# Altium project telecar.PrjPcb
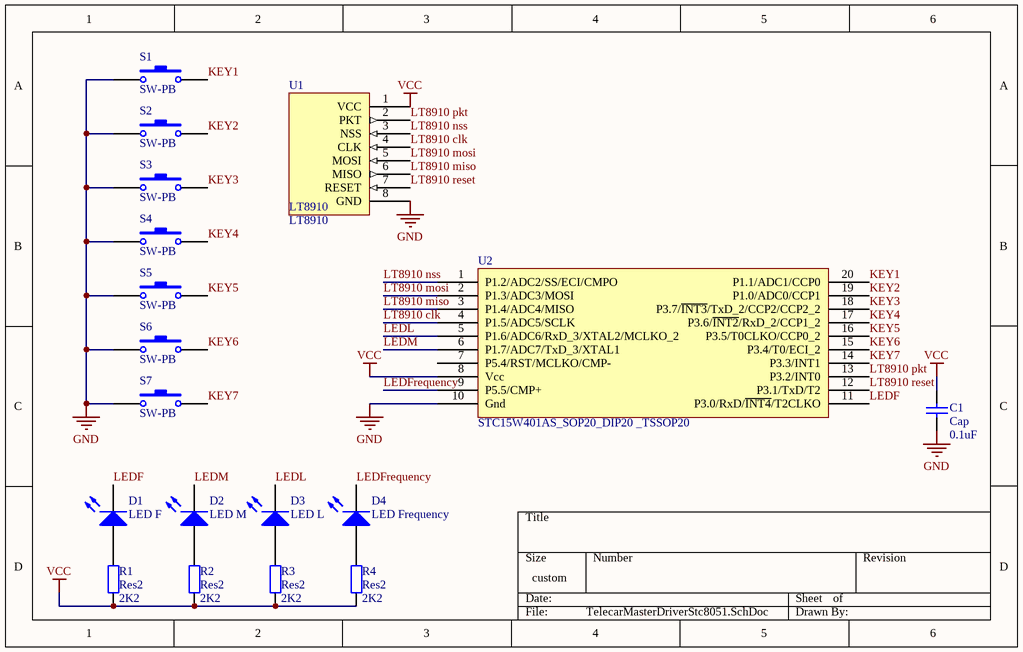
[diagram p0: TelecarMasterDriverStc8051.SchDoc]
2 sheets, 39 parts. Net scope: global (net labels, ports and power ports of the same name join across sheets).
Board files: TelecarMasterDriverStc8051.PcbDoc, TelecarRemoteControlStc8051.PcbDoc
Sheets:
  TelecarMasterDriverStc8051.SchDoc
  TelecarRemoteControlStc8051.SchDoc

## Sheet TelecarMasterDriverStc8051.SchDoc
size 190 x 120 mm; PageSetup: Record=PageOptions?CenterHorizontal=True?CenterVertical=True?PrintScale=0.67?XCorrection=1.00?YCorrection=1.00?PrintKind=1?BorderSize=5000000?LeftOffset=0?BottomOffset=0?Orientation=2?PaperLength=1000?PaperWidth=1000?Scale=100?PaperSource=7?PrintQuality=-4?MediaType=1?DitherType=10?PaperKind=A5?PrintScaleMode=1

### Parts
C1  Cap  value 0.1uF  [RAD-0.3]
D1  LED F  [LED-1]
D2  LED M  [LED-1]
D3  LED L  [LED-1]
D4  LED Frequency  [LED-1]
R1  Res2  value 2K2  [AXIAL-0.4]
R2  Res2  value 2K2  [AXIAL-0.4]
R3  Res2  value 2K2  [AXIAL-0.4]
R4  Res2  value 2K2  [AXIAL-0.4]
S1  SW-PB  [SPST-2]
S2  SW-PB  [SPST-2]
S3  SW-PB  [SPST-2]
S4  SW-PB  [SPST-2]
S5  SW-PB  [SPST-2]
S6  SW-PB  [SPST-2]
S7  SW-PB  [SPST-2]
U1  LT8910
U2  STC15W401AS_SOP20_DIP20 _TSSOP20  [TSSOP20]

### Nets
GND: C1.1 S1.1 S2.1 S3.1 S4.1 S5.1 S6.1 S7.1 U1.8(GND) U2.10(Gnd)
VCC: C1.2 R1.1 R2.1 R3.1 R4.1 U1.1(VCC) U2.8(Vcc)
KEY1: S1.2 U2.20(P1.1/ADC1/CCP0)
KEY2: S2.2 U2.19(P1.0/ADC0/CCP1)
KEY3: S3.2 U2.18(P3.7/~{INT3}/TxD_2/CCP2/CCP2_2)
KEY4: S4.2 U2.17(P3.6/~{INT2}/RxD_2/CCP1_2)
KEY5: S5.2 U2.16(P3.5/T0CLKO/CCP0_2)
KEY6: S6.2 U2.15(P3.4/T0/ECI_2)
KEY7: S7.2 U2.14(P3.3/INT1)
LEDF: D1.2(K) U2.11(P3.0/RxD/~{INT4}/T2CLKO)
LEDFrequency: D4.2(K) U2.9(P5.5/CMP+)
LEDL: D3.2(K) U2.5(P1.6/ADC6/RxD_3/XTAL2/MCLKO_2)
LEDM: D2.2(K) U2.6(P1.7/ADC7/TxD_3/XTAL1)
LT8910 clk: U1.4(CLK) U2.4(P1.5/ADC5/SCLK)
LT8910 miso: U1.6(MISO) U2.3(P1.4/ADC4/MISO)
LT8910 mosi: U1.5(MOSI) U2.2(P1.3/ADC3/MOSI)
LT8910 nss: U1.3(NSS) U2.1(P1.2/ADC2/SS/ECI/CMPO)
LT8910 pkt: U1.2(PKT) U2.13(P3.2/INT0)
LT8910 reset: U1.7(RESET) U2.12(P3.1/TxD/T2)
NetD1_1: D1.1(A) R1.2
NetD2_1: D2.1(A) R2.2
NetD3_1: D3.1(A) R3.2
NetD4_1: D4.1(A) R4.2

Not connected (* = marked no-connect by the designer): U2 7(P5.4/RST/MCLKO/CMP-)

### Library data of the parts
C1 = Cap: Capacitor; Published: 8-Jun-2000; LatestRevisionDate: 17-Jul-2002; LatestRevisionNote: Re-released for DXP Platform.; PackageReference: RAD-0.3; Publisher: Altium Limited
D1-D4 = LED1: Typical RED GaAs LED; Published: 8-Jun-2000; LatestRevisionDate: 08-Jul-2005; LatestRevisionNote: Mech Layer 1 removed.; PackageReference: LED-1; Publisher: Altium Limited
R1-R4 = Res2: Resistor; Published: 8-Jun-2000; LatestRevisionDate: 17-Jul-2002; LatestRevisionNote: Re-released for DXP Platform.; PackageReference: AXIAL-0.4; Publisher: Altium Limited
S1-S7 = SW-PB: Switch; Published: 24-Mar-1999; LatestRevisionDate: 17-Jul-2002; LatestRevisionNote: Re-released for DXP Platform.; PackageReference: SPST-2; Publisher: Altium Limited

## Sheet TelecarRemoteControlStc8051.SchDoc
size 190 x 120 mm
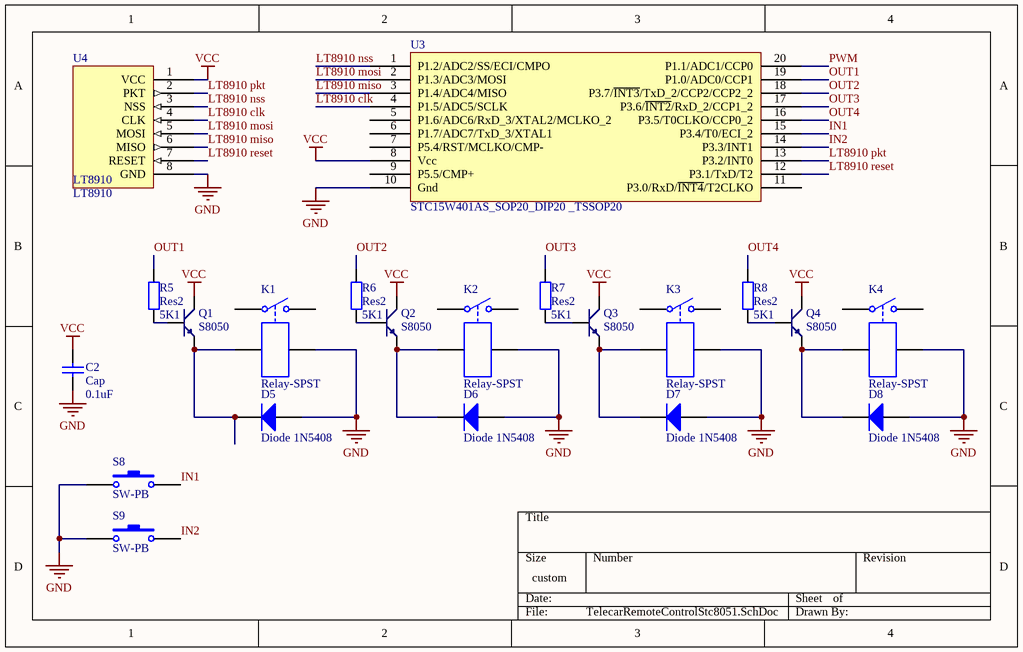
[diagram p1: TelecarRemoteControlStc8051.SchDoc]

### Parts
C2  Cap  value 0.1uF  [RAD-0.3]
D5  Diode 1N5408  [DIO18.84-9.6x5.6]
D6  Diode 1N5408  [DIO18.84-9.6x5.6]
D7  Diode 1N5408  [DIO18.84-9.6x5.6]
D8  Diode 1N5408  [DIO18.84-9.6x5.6]
K1  Relay-SPST  [DIP-P4]
K2  Relay-SPST  [DIP-P4]
K3  Relay-SPST  [DIP-P4]
K4  Relay-SPST  [DIP-P4]
Q1  S8050  [SOT-23R]
Q2  S8050  [SOT-23R]
Q3  S8050  [SOT-23R]
Q4  S8050  [SOT-23R]
R5  Res2  value 5K1  [AXIAL-0.4]
R6  Res2  value 5K1  [AXIAL-0.4]
R7  Res2  value 5K1  [AXIAL-0.4]
R8  Res2  value 5K1  [AXIAL-0.4]
S8  SW-PB  [SPST-2]
S9  SW-PB  [SPST-2]
U3  STC15W401AS_SOP20_DIP20 _TSSOP20  [TSSOP20]
U4  LT8910

### Nets
GND: C2.1 D5.1(A) D6.1(A) D7.1(A) D8.1(A) K1.4 K2.4 K3.4 K4.4 S8.1 S9.1 U3.10(Gnd) U4.8(GND)
VCC: C2.2 Q1.3(C) Q2.3(C) Q3.3(C) Q4.3(C) U3.8(Vcc) U4.1(VCC)
IN1: S8.2 U3.15(P3.4/T0/ECI_2)
IN2: S9.2 U3.14(P3.3/INT1)
LT8910 clk: U3.4(P1.5/ADC5/SCLK) U4.4(CLK)
LT8910 miso: U3.3(P1.4/ADC4/MISO) U4.6(MISO)
LT8910 mosi: U3.2(P1.3/ADC3/MOSI) U4.5(MOSI)
LT8910 nss: U3.1(P1.2/ADC2/SS/ECI/CMPO) U4.3(NSS)
LT8910 pkt: U3.13(P3.2/INT0) U4.2(PKT)
LT8910 reset: U3.12(P3.1/TxD/T2) U4.7(RESET)
OUT1: R5.2 U3.19(P1.0/ADC0/CCP1)
OUT2: R6.2 U3.18(P3.7/~{INT3}/TxD_2/CCP2/CCP2_2)
OUT3: R7.2 U3.17(P3.6/~{INT2}/RxD_2/CCP1_2)
OUT4: R8.2 U3.16(P3.5/T0CLKO/CCP0_2)
PWM: U3.20(P1.1/ADC1/CCP0)
NetD5_2: D5.2(K) K1.3 Q1.1(E)
NetD6_2: D6.2(K) K2.3 Q2.1(E)
NetD7_2: D7.2(K) K3.3 Q3.1(E)
NetD8_2: D8.2(K) K4.3 Q4.1(E)
NetQ1_2: Q1.2(B) R5.1
NetQ2_2: Q2.2(B) R6.1
NetQ3_2: Q3.2(B) R7.1
NetQ4_2: Q4.2(B) R8.1

Not connected (* = marked no-connect by the designer): K1 1 2; K2 1 2; K3 1 2; K4 1 2; U3 5(P1.6/ADC6/RxD_3/XTAL2/MCLKO_2) 6(P1.7/ADC7/TxD_3/XTAL1) 7(P5.4/RST/MCLKO/CMP-) 9(P5.5/CMP+) 11(P3.0/RxD/~{INT4}/T2CLKO)

### Library data of the parts
C2 = Cap: Capacitor; Published: 8-Jun-2000; LatestRevisionDate: 17-Jul-2002; LatestRevisionNote: Re-released for DXP Platform.; PackageReference: RAD-0.3; Publisher: Altium Limited
D5-D8 = Diode 1N5408: 3 Amp Medium Power Silicon Rectifier Diode; Published: 8-Jun-2000; LatestRevisionDate: 17-Jul-2002; LatestRevisionNote: Re-released for DXP Platform.; DatasheetVersion: Aug-1984; PackageReference: DO-201AD; Publisher: Altium Limited; ComponentLink1Description: Manufacturer Link; ComponentLink1URL: http://www.irf.com/
K1-K4 = Relay-SPST: Single-Pole Single-Throw Relay; Published: 24-Mar-1999; LatestRevisionDate: 17-Jul-2002; LatestRevisionNote: Re-released for DXP Platform.; PackageReference: MODULE4; Publisher: Altium Limited
Q1-Q4 = NPN: 8050/BCW846/BCW847
R5-R8 = Res2: Resistor; Published: 8-Jun-2000; LatestRevisionDate: 17-Jul-2002; LatestRevisionNote: Re-released for DXP Platform.; PackageReference: AXIAL-0.4; Publisher: Altium Limited
S8 S9 = SW-PB: Switch; Published: 24-Mar-1999; LatestRevisionDate: 17-Jul-2002; LatestRevisionNote: Re-released for DXP Platform.; PackageReference: SPST-2; Publisher: Altium Limited

## Nets that join several sheets
GND: TelecarMasterDriverStc8051 (10 pins), TelecarRemoteControlStc8051 (13 pins)
VCC: TelecarMasterDriverStc8051 (7 pins), TelecarRemoteControlStc8051 (7 pins)
LT8910 clk: TelecarMasterDriverStc8051 (U1.4 U2.4), TelecarRemoteControlStc8051 (U3.4 U4.4)
LT8910 miso: TelecarMasterDriverStc8051 (U1.6 U2.3), TelecarRemoteControlStc8051 (U3.3 U4.6)
LT8910 mosi: TelecarMasterDriverStc8051 (U1.5 U2.2), TelecarRemoteControlStc8051 (U3.2 U4.5)
LT8910 nss: TelecarMasterDriverStc8051 (U1.3 U2.1), TelecarRemoteControlStc8051 (U3.1 U4.3)
LT8910 pkt: TelecarMasterDriverStc8051 (U1.2 U2.13), TelecarRemoteControlStc8051 (U3.13 U4.2)
LT8910 reset: TelecarMasterDriverStc8051 (U1.7 U2.12), TelecarRemoteControlStc8051 (U3.12 U4.7)